# Altium schematic sheet Schematic.SchDoc
size A; SheetNumber: 1; SheetTotal: 4
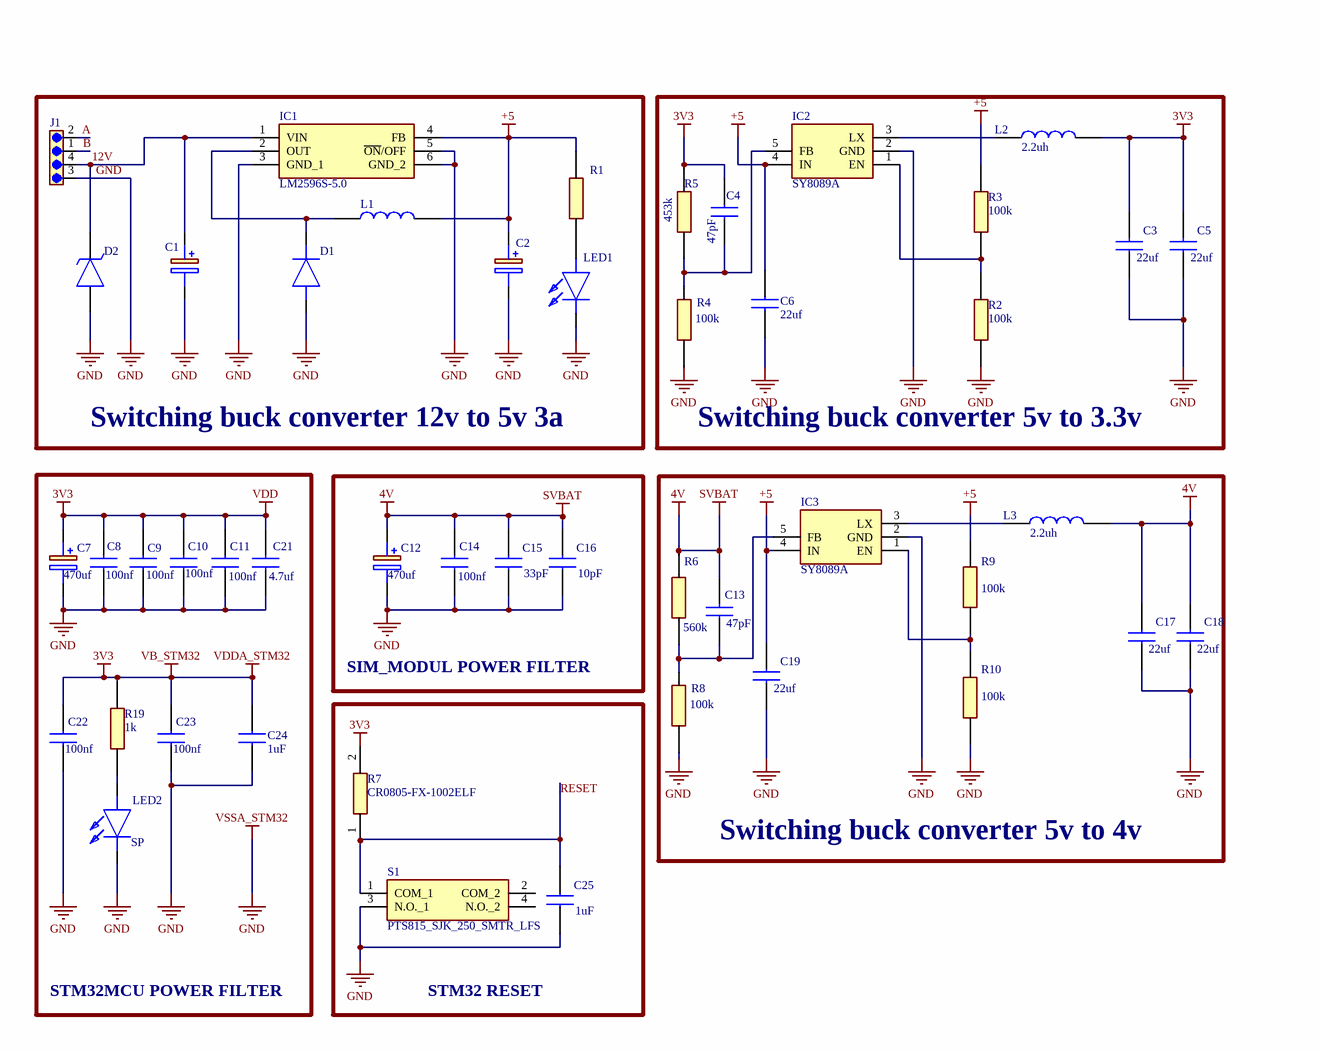
[diagram p0: Schematic.SchDoc, left]

## Parts
C1  B40900B5477M000  [CAPAE1030X1280N]  (value not drawn)
C2  220uf  [CAPPM7344X310N]  (value not drawn)
C3  22uf  [CAPC2012X140N]
C4  47pF  [C0603]
C5  22uf  [CAPC2012X140N]
C6  22uf  [CAPC2012X140N]
C7  470uf  [T495D]
C8  100nf  [CAPC1608X90N]
C9  100nf  [CAPC1608X90N]
C10  100nf  [CAPC1608X90N]
C11  100nf  [CAPC1608X90N]
C12  470uf  [T495D]
C13  47pF  [C0603]
C14  100nf  [CAPC1608X90N]
C15  33pF  [CAPC0603X33N]
C16  10pF  [CAPC1608X90N]
C17  22uf  [CAPC2012X140N]
C18  22uf  [CAPC2012X140N]
C19  22uf  [CAPC2012X140N]
C21  4.7uf  [CAPC2012X152N]
C22  100nf  [CAPC1608X90N]
C23  100nf  [CAPC1608X90N]
C24  1uF  [CAPC1608X90N]
C25  1uF  [CAPC1608X90N]
D1  SS54B  [DIOM5336X244N]  (value not drawn)
D2  ESDA17P50-1U1M  [ESDA17P501U1M]  (value not drawn)
IC1  LM2596S-5.0  [KTT0005B]
IC2  SY8089A  [SOT95P285X140-5N]
IC3  SY8089A  [SOT95P285X140-5N]
J1  691322310004  [691322310004]  (value not drawn)
L1  SRR1260-330M  [SRR1260-150M]  (value not drawn)
L2  2.2uh  [MPLAL50302R2]
L3  2.2uh  [MPLAL50302R2]
LED1  150080GS75000  [LEDM2012X80N]  (value not drawn)
LED2  SP  [LEDC2012X110N]
R1  150R  [RESC2012X65N]  (value not drawn)
R2  100k  [RESC2012X60N]
R3  100k  [RESC2012X60N]
R4  100k  [RESC2012X60N]
R5  453k  [RESC2012X60N]
R6  560k  [RESC2012X65N]
R7  CR0805-FX-1002ELF  [RESC2012X60N]
R8  100k  [RESC2012X60N]
R9  100k  [RESC2012X60N]
R10  100k  [RESC2012X60N]
R19  1k  [RESC1005X40N]
S1  PTS815_SJK_250_SMTR_LFS  [PTS815SJK250SMTRLFS]

## Blocks framed on the sheet
Switching buck converter 12v to 5v 3a: C1 C2 D1 D2 IC1 J1 L1 LED1 R1
Switching buck converter 5v to 3.3v: C3-C6 IC2 L2 R2-R5
STM32MCU POWER FILTER: C7-C11 C21-C24 LED2 R19
SIM_MODUL POWER FILTER: C12 C14-C16
Switching buck converter 5v to 4v: C13 C17-C19 IC3 L3 R6 R8-R10
STM32 RESET: C25 R7 S1

## Nets
3V3: C3.2 C4.2 C5.2 C7.1(+) C8.2 C9.2 C10.2 C11.2 C21.2 C22.2 C23.2 C24.2 L2.2 R5.2 R7.2 R19.2  [also labelled VB_STM32, VDD, VDDA_STM32]
4V: C12.1(+) C13.2 C14.2 C15.2 C16.2(C2) C17.2 C18.2 L3.2 R6.2  [also labelled SVBAT]
+5: C2.1(+) C6.2 C19.2 IC1.4(FB) IC2.4(IN) IC3.4(IN) L1.2 R1.2 R3.2 R9.2
GND: C1.2(-) C2.2(-) C3.1 C5.1 C6.1 C7.2(-) C8.1 C9.1 C10.1 C11.1 C12.2(-) C14.1 C15.1 C16.1(C1) C17.1 C18.1 C19.1 C21.1 C22.1 C23.1 C24.1 C25.1 D1.2(A) D2.2(A) IC1.3(GND_1) IC1.5(~{ON}/OFF) IC1.6(GND_2) IC2.2(GND) IC3.2(GND) J1.3 LED1.1(K) LED2.1(K) R2.1 R4.1 R8.1 R10.1 S1.3(N.O._1)  [also labelled VSSA_STM32]
12V: C1.1(+) D2.1(K) IC1.1(VIN) J1.4
A: J1.2
B: J1.1
RESET: C25.2 R7.1 S1.1(COM_1)
NetC4_1: C4.1 IC2.5(FB) R4.2 R5.1
NetC13_1: C13.1 IC3.5(FB) R6.1 R8.2
NetD1_1: D1.1(K) IC1.2(OUT) L1.1
NetIC2_1: IC2.1(EN) R2.2 R3.1
NetIC2_3: IC2.3(LX) L2.1
NetIC3_1: IC3.1(EN) R9.1 R10.2
NetIC3_3: IC3.3(LX) L3.1
NetLED1_2: LED1.2(A) R1.1
NetLED2_2: LED2.2(A) R19.1

Not connected (* = marked no-connect by the designer): S1 2(COM_2) 4(N.O._2)

## Library data of the parts
C1 = B40900B5477M000: Capacitor Polarised; Manufacturer_Name: TDK; Datasheet Link: https://product.tdk.com/system/files/dam/doc/product/capacitor/aluminum-electrolytic/hybrid-polymer/data_sheet/20/30/db/aec/b40900.pdf; Height: 12.8mm; Manufacturer_Part_Number: B40900B5477M000; Mouser Part Number: 871-B40900B5477M000; Mouser Price/Stock: https://www.mouser.co.uk/ProductDetail/EPCOS-TDK/B40900B5477M000?qs=sPbYRqrBIVkjJ1xmSzm%2FSw%3D%3D
C2 = TAJD227K010RNJ: Capacitor Polarised 220uf 10v smd tantalum Part Number: TAJD227K010RNJ; Manufacturer_Name: AVX; Datasheet Link: http://datasheets.avx.com/TAJ.pdf; Height: 3.1mm; Manufacturer_Part_Number: TAJD227K010RNJ; Mouser Part Number: 581-TAJD227K010R; Mouser Price/Stock: https://www.mouser.co.uk/ProductDetail/AVX/TAJD227K010RNJ?qs=min0%252Bk%2FlUAadDEgYeVIB%252Bw%3D%3D; Arrow Part Number: TAJD227K010RNJ; Arrow Price/Stock: https://www.arrow.com/en/products/tajd227k010rnj/avx
C3 C5 C6 C17-C19 = CL21X226MQQNNNE: Capacitor; Manufacturer_Name: SAMSUNG; Datasheet Link: https://product.samsungsem.com/part/download.do; Height: 1.4mm; Manufacturer_Part_Number: CL21X226MQQNNNE; Mouser Part Number: N/A; Mouser Price/Stock: https://www.mouser.com/Search/Refine.aspx?Keyword=N%2FA; Arrow Part Number: CL21X226MQQNNNE; Arrow Price/Stock: https://www.arrow.com/en/products/cl21x226mqqnnne/samsung-electro-mechanics
C4 C13 = C0603H470J5GACTU: Capacitor Part Number: C0603H470J5GACTU 47pf 50v 0603; Manufacturer_Name: KEMET; Datasheet Link: https://content.kemet.com/datasheets/KEM_C1001_C0G_200C_SMD.pdf; Height: 0.87mm; Manufacturer_Part_Number: C0603H470J5GACTU; Mouser Part Number: 80-C0603H470J5GACTU; Mouser Price/Stock: https://www.mouser.co.uk/ProductDetail/KEMET/C0603H470J5GACTU?qs=OlC7AqGiEDlBSvW2T4T4RQ%3D%3D
C7 C12 = T495D477K006ATE100: Capacitor Polarised; Manufacturer_Name: KEMET; Datasheet Link: https://content.kemet.com/datasheets/KEM_T2009_T495.pdf; Height: 3.1mm; Manufacturer_Part_Number: T495D477K006ATE100; Mouser Part Number: 80-T495D477K006E100; Mouser Price/Stock: https://www.mouser.co.uk/ProductDetail/KEMET/T495D477K006ATE100?qs=JMiwNnuXh3pQ954ydQHvqQ%3D%3D; Arrow Part Number: T495D477K006ATE100; Arrow Price/Stock: https://www.arrow.com/en/products/t495d477k006ate100/kemet-corporation?region=nac
C8-C11 C14 C22 C23 = 06036C104MAZ2A: Capacitor; Manufacturer_Name: AVX; Datasheet Link: https://componentsearchengine.com/Datasheets/1/06031A100FAT2A.pdf; Height: 0.9mm; Manufacturer_Part_Number: 06036C104MAZ2A; Mouser Part Number: 581-06036C104MAZ2A; Mouser Price/Stock: https://www.mouser.co.uk/ProductDetail/AVX/06036C104MAZ2A?qs=9g9l2Gjnh0s%2FYval7p6%252B1g%3D%3D; Arrow Part Number: 06036C104MAZ2A; Arrow Price/Stock: https://www.arrow.com/en/products/06036c104maz2a/avx
C15 = GJM0335C0J330JB01D: Capacitor; Manufacturer_Name: Murata Electronics; Datasheet Link: https://datasheet.datasheetarchive.com/originals/distributors/Datasheets_SAMA/1b8ebccddda42a85d5d2941bb85cddb2.pdf; Height: 0.33mm; Manufacturer_Part_Number: GJM0335C0J330JB01D; Mouser Part Number: 81-GJM0335C0J330JB1D; Mouser Price/Stock: https://www.mouser.co.uk/ProductDetail/Murata-Electronics/GJM0335C0J330JB01D?qs=563MOeNa05KY2adUKCPfEg%3D%3D; Arrow Part Number: GJM0335C0J330JB01D; Arrow Price/Stock: https://www.arrow.com/en/products/gjm0335c0j330jb01d/murata-manufacturing
C16 = CC0603JRNPO9BN100: Capacitor; Manufacturer_Name: KEMET; Manufacturer_Part_Number: CC0603JRNPO9BN100; Mouser Part Number: 603-C0603JRNPO9BN100; Mouser Price/Stock: https://www.mouser.co.uk/ProductDetail/Yageo/CC0603JRNPO9BN100?qs=vTakOoo5QyIFwFOmdMrXhw%3D%3D; Arrow Part Number: CC0603JRNPO9BN100; Arrow Price/Stock: https://www.arrow.com/en/products/cc0603jrnpo9bn100/yageo
C21 = 08056D475MAT2A: Capacitor; Manufacturer_Name: AVX; Datasheet Link: https://spicat.kyocera-avx.com/product/mlcc/chartview/08056D475MAT2A/DataSheet/X5R; Height: 1.52mm; Manufacturer_Part_Number: 08056D475MAT2A; Mouser Part Number: 581-08056D475M; Mouser Price/Stock: https://www.mouser.com/Search/Refine.aspx?Keyword=581-08056D475M
C24 C25 = 06036C105MAT2A: Capacitor; Manufacturer_Name: AVX; Datasheet Link: https://componentsearchengine.com/Datasheets/1/06031A100FAT2A.pdf; Height: 0.9mm; Manufacturer_Part_Number: 06036C105MAT2A; Mouser Part Number: 581-06036C105MAT2A; Mouser Price/Stock: https://www.mouser.co.uk/ProductDetail/AVX/06036C105MAT2A?qs=1X9trZCrWl0x0jW7AUsrpw%3D%3D; Arrow Part Number: 06036C105MAT2A; Arrow Price/Stock: https://www.arrow.com/en/products/06036c105mat2a/avx
D1 = SS54B: Diode; Manufacturer_Name: HY Electronic; Datasheet Link: https://datasheet.datasheetarchive.com/originals/distributors/Datasheets-3/DSA-43270.pdf; Height: 2.44mm; Manufacturer_Part_Number: SS54B
D2 = ESDA17P50-1U1M: TVS Diode (Uni-directional); Manufacturer_Name: STMicroelectronics; Datasheet Link: http://www.st.com/content/ccc/resource/technical/document/datasheet/group3/21/d7/38/9c/80/7e/49/d0/DM00304840/files/DM00304840.pdf/jcr:content/translations/en.DM00304840.pdf; Height: 0.6mm; Manufacturer_Part_Number: ESDA17P50-1U1M; Mouser Part Number: 511-ESDA17P50-1U1M; Mouser Price/Stock: https://www.mouser.co.uk/ProductDetail/STMicroelectronics/ESDA17P50-1U1M?qs=aVyJF2WnouQ6X0XKPX5Sbg%3D%3D; Arrow Part Number: ESDA17P50-1U1M; Arrow Price/Stock: https://www.arrow.com/en/products/esda17p50-1u1m/stmicroelectronics?region=nac
IC1 = LM2596S-5.0: Integrated Circuit; Manufacturer_Name: Texas Instruments; Datasheet Link: https://www.ti.com/lit/gpn/LM2596; Manufacturer_Part_Number: LM2596S-5.0; Mouser Part Number: 926-LM2596S-50; Mouser Price/Stock: https://www.mouser.co.uk/ProductDetail/Texas-Instruments/LM2596S-5.0?qs=X1J7HmVL2ZGcOr96VNr%252B%2Fw%3D%3D; Arrow Part Number: LM2596S-5.0; Arrow Price/Stock: https://www.arrow.com/en/products/lm2596s-5.0/texas-instruments?region=nac
IC2 IC3 = SY8089A: Integrated Circuit; Manufacturer_Name: Silergy; Datasheet Link: https://datasheet.lcsc.com/szlcsc/SY8089AAAC_C78988.pdf; Height: 1.4mm; Manufacturer_Part_Number: SY8089A
J1 = 691322310004: 4 Position Terminal Block Header, Male Pins, Shrouded (4 Side) 0.150 (3.81mm) 90Â°, Right Angle Through Hole; MF: Wurth Electronics; SnapEDA_Link: https://www.snapeda.com/parts/691322310004/Wurth+Electronics+Inc./view-part/?ref=snap; Package: None; Value: *; MP: 691322310004; Check_prices: https://www.snapeda.com/parts/691322310004/Wurth+Electronics+Inc./view-part/?ref=eda
L1 = SRR1260-330M: Inductor 33uH; Manufacturer_Name: Bourns; Datasheet Link: https://www.bourns.com/docs/Product-Datasheets/SRR1260.pdf; Manufacturer_Part_Number: SRR1260-330M; Mouser Part Number: 652-SRR1260-330M; Mouser Price/Stock: https://www.mouser.co.uk/ProductDetail/Bourns/SRR1260-330M?qs=R2jSSvul3fC3V4%252BTrq0P0w%3D%3D; Arrow Part Number: SRR1260-330M; Arrow Price/Stock: https://www.arrow.com/en/products/srr1260-330m/bourns?region=nac
L2 L3 = MPL-AL5030-2R2: Inductor Part Number :MPL-AL5030-2R2; Manufacturer_Name: Monolithic Power Systems (MPS); Datasheet Link: https://www.monolithicpower.com/en/documentview/productdocument/index/version/2/document_type/Datasheet/lang/en/sku/MPL-AL5030-2R2/document_id/5804; Height: 3.1mm; Manufacturer_Part_Number: MPL-AL5030-2R2; Mouser Part Number: 946-MPL-AL5030-2R2; Mouser Price/Stock: https://www.mouser.co.uk/ProductDetail/Monolithic-Power-Systems-MPS/MPL-AL5030-2R2?qs=sPbYRqrBIVnhOZ%2F5ltO9Lw%3D%3D
LED1 = 150080GS75000: LED; Manufacturer_Name: Wurth Elektronik; Datasheet Link: https://katalog.we-online.com/led/datasheet/150080GS75000.pdf; Height: 0.8mm; Manufacturer_Part_Number: 150080GS75000; Mouser Part Number: 710-150080GS75000; Mouser Price/Stock: https://www.mouser.co.uk/ProductDetail/Wurth-Elektronik/150080GS75000?qs=2kOmHSv6VfQRoTEZVk1mGA%3D%3D
LED2 = SM0805RC: LED; Manufacturer_Name: Bivar; Datasheet Link: https://componentsearchengine.com/Datasheets/1/SM0805RC.pdf; Height: 1.1mm; Manufacturer_Part_Number: SM0805RC; Mouser Part Number: 749-SM0805RC; Mouser Price/Stock: https://www.mouser.co.uk/ProductDetail/Bivar/SM0805RC?qs=jaLxTFIJCivm3JSYe5gHjQ%3D%3D
R1 = RMCF0805FT150R: Resistor 0805 150R 1/4W; Manufacturer_Name: Stackpole Electronics; Datasheet Link: https://cs.seielect.com/catalog/SEI-RMCF_RMCP.pdf; Height: 0.65mm; Manufacturer_Part_Number: RMCF0805FT150R; Mouser Part Number: 708-RMCF0805FT150R; Mouser Price/Stock: https://www.mouser.co.uk/ProductDetail/SEI-Stackpole/RMCF0805FT150R?qs=FESYatJ8odKRN1MTHzs13Q%3D%3D; Arrow Part Number: RMCF0805FT150R; Arrow Price/Stock: https://www.arrow.com/en/products/rmcf0805ft150r/stackpole-electronics?region=nac
R2-R4 R8-R10 = CR0805-FX-1003ELF: Resistor; Manufacturer_Name: Bourns; Datasheet Link: https://www.bourns.com/pdfs/chpreztr.pdf; Height: 0.6mm; Manufacturer_Part_Number: CR0805-FX-1003ELF; Mouser Part Number: 652-CR0805FX-1003ELF; Mouser Price/Stock: https://www.mouser.co.uk/ProductDetail/Bourns/CR0805-FX-1003ELF?qs=tknLyCMIRbPd3RvyRhvkuQ%3D%3D; Arrow Part Number: CR0805-FX-1003ELF; Arrow Price/Stock: https://www.arrow.com/en/products/cr0805-fx-1003elf/bourns?region=nac
R5 = RK73H2ATTD4533F: Resistor 453k 0805 1/4w; Manufacturer_Name: KOA Speer; Datasheet Link: http://www.koaspeer.com/catimages/Products/RK73H/RK73H.pdf; Height: 0.6mm; Manufacturer_Part_Number: RK73H2ATTD4533F; Mouser Part Number: 660-RK73H2ATTD4533F; Mouser Price/Stock: https://www.mouser.com/Search/Refine.aspx?Keyword=660-RK73H2ATTD4533F; Arrow Part Number: RK73H2ATTD4533F; Arrow Price/Stock: https://www.arrow.com/en/products/rk73h2attd4533f/koa-speer-electronics
R6 = CPF0805B560KE: Resistor; Manufacturer_Name: TE Connectivity; Datasheet Link: http://docs-europe.electrocomponents.com/webdocs/13d1/0900766b813d116f.pdf; Height: 0.65mm; Manufacturer_Part_Number: CPF0805B560KE
R7 = CR0805-FX-1002ELF: Resistor; Manufacturer_Name: Bourns; Datasheet Link: https://www.bourns.com/pdfs/chpreztr.pdf; Height: 0.6mm; Manufacturer_Part_Number: CR0805-FX-1002ELF; Mouser Part Number: 652-CR0805FX-1002ELF; Mouser Price/Stock: https://www.mouser.co.uk/ProductDetail/Bourns/CR0805-FX-1002ELF?qs=tknLyCMIRbPr%252BDD0s0nG9g%3D%3D; Arrow Part Number: CR0805-FX-1002ELF; Arrow Price/Stock: https://www.arrow.com/en/products/cr0805-fx-1002elf/bourns?region=nac
R19 = RC0402JR-071KL: Resistor; Manufacturer_Name: KEMET; Datasheet Link: http://www.yageo.com/documents/recent/PYu-RC0402_51_RoHS_L_6_r.pdf; Height: 0.4mm; Manufacturer_Part_Number: RC0402JR-071KL; Mouser Part Number: 603-RC0402JR-071KL; Mouser Price/Stock: https://www.mouser.co.uk/ProductDetail/YAGEO/RC0402JR-071KL?qs=uM1JSSdPjOCtzNbByOhClA%3D%3D; Arrow Part Number: RC0402JR-071KL; Arrow Price/Stock: https://www.arrow.com/en/products/rc0402jr-071kl/yageo?region=europe
S1 = PTS815_SJK_250_SMTR_LFS: Switch; Manufacturer_Name: C & K COMPONENTS; Manufacturer_Part_Number: PTS815 SJK 250 SMTR LFS; Datasheet Link: https://www.mouser.com/datasheet/2/60/pts815-1535658.pdf; Height: 2mm; Mouser Part Number: 611-PTS815SJK250SMTR; Mouser Price/Stock: https://www.mouser.co.uk/ProductDetail/CK/PTS815-SJK-250-SMTR-LFS?qs=ahcBuItHZ3yETpGYMHf%2FgQ%3D%3D; Arrow Part Number: PTS815 SJK 250 SMTR LFS; Arrow Price/Stock: https://www.arrow.com/en/products/pts815-sjk-250-smtr-lfs/ck